# Altium schematic sheet GongxunZhukong.SchDoc
size A2; SheetNumber: 1; SheetTotal: 1
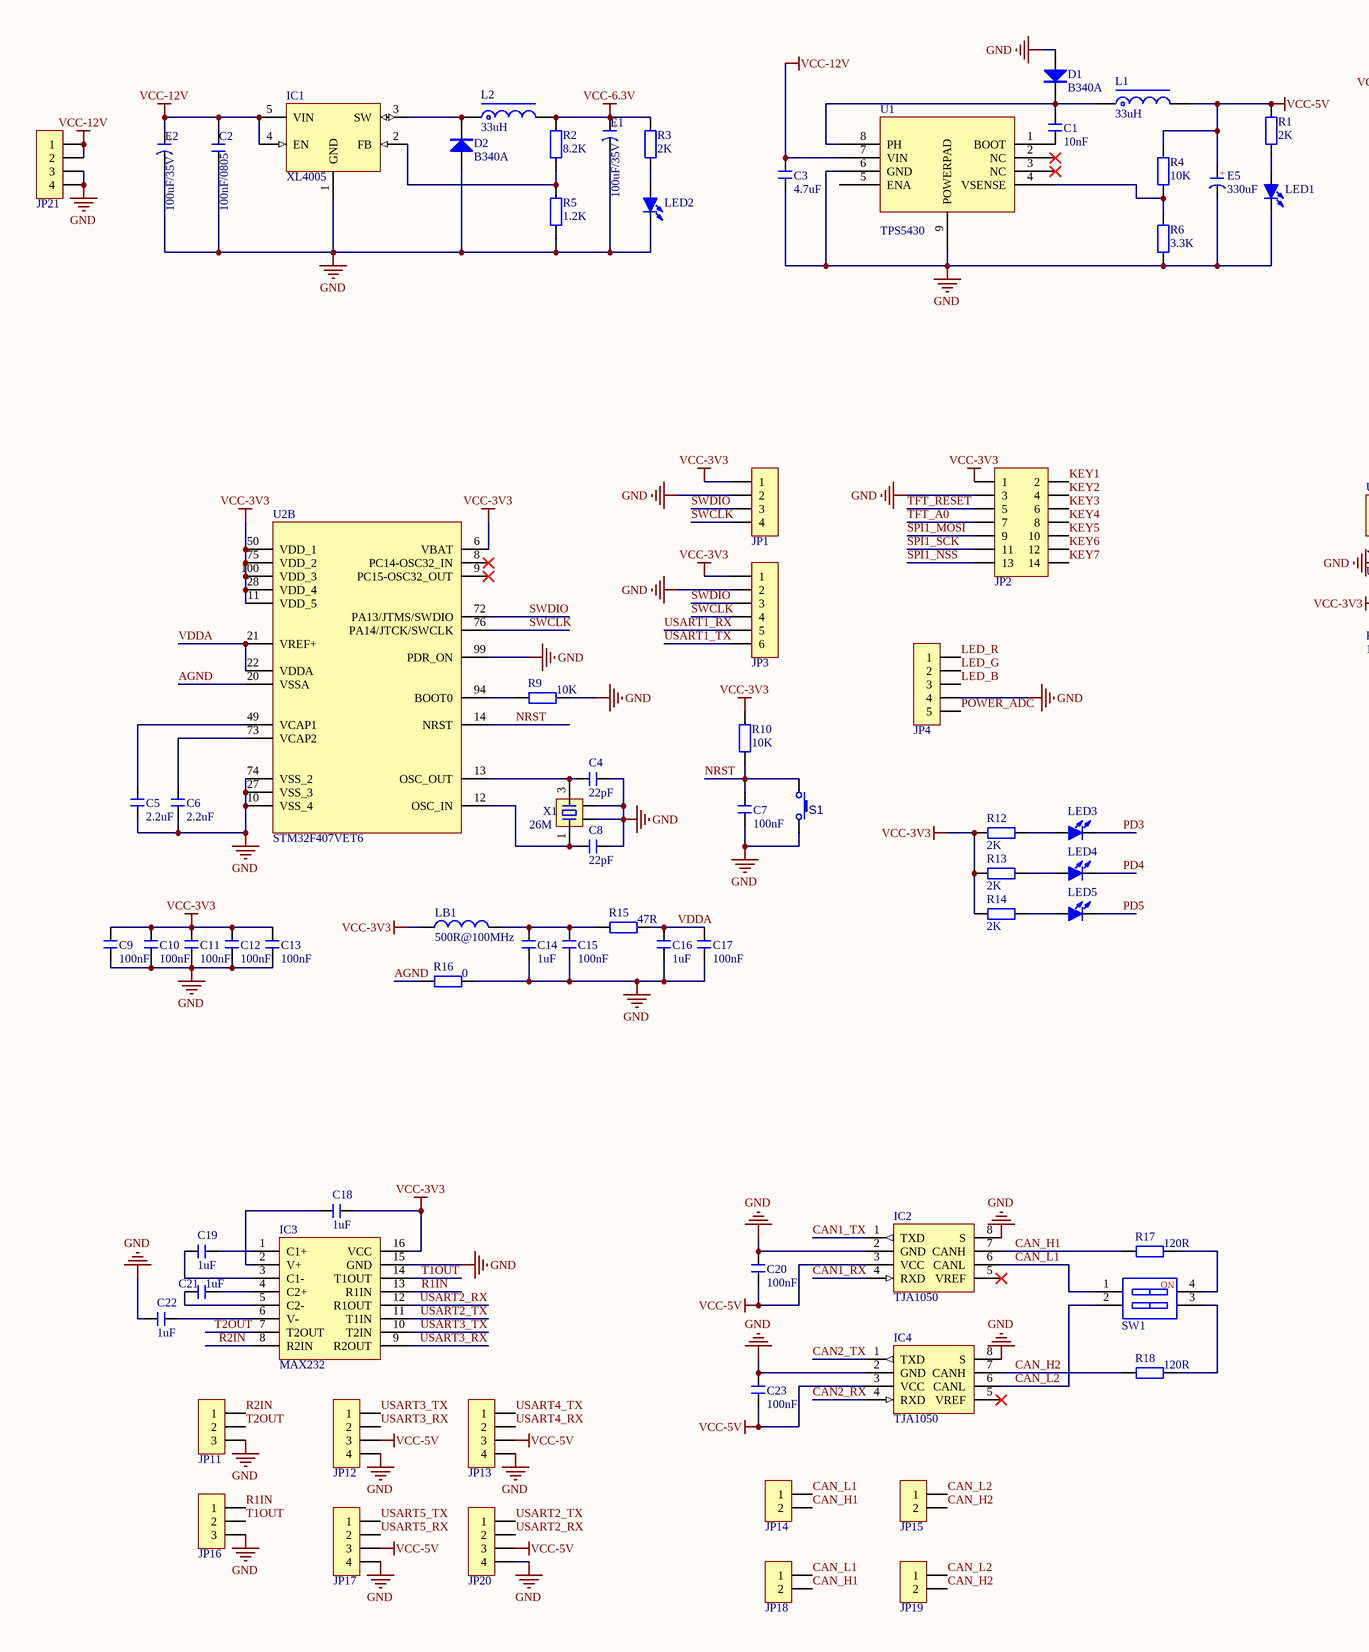
[diagram p0: GongxunZhukong.SchDoc, left]
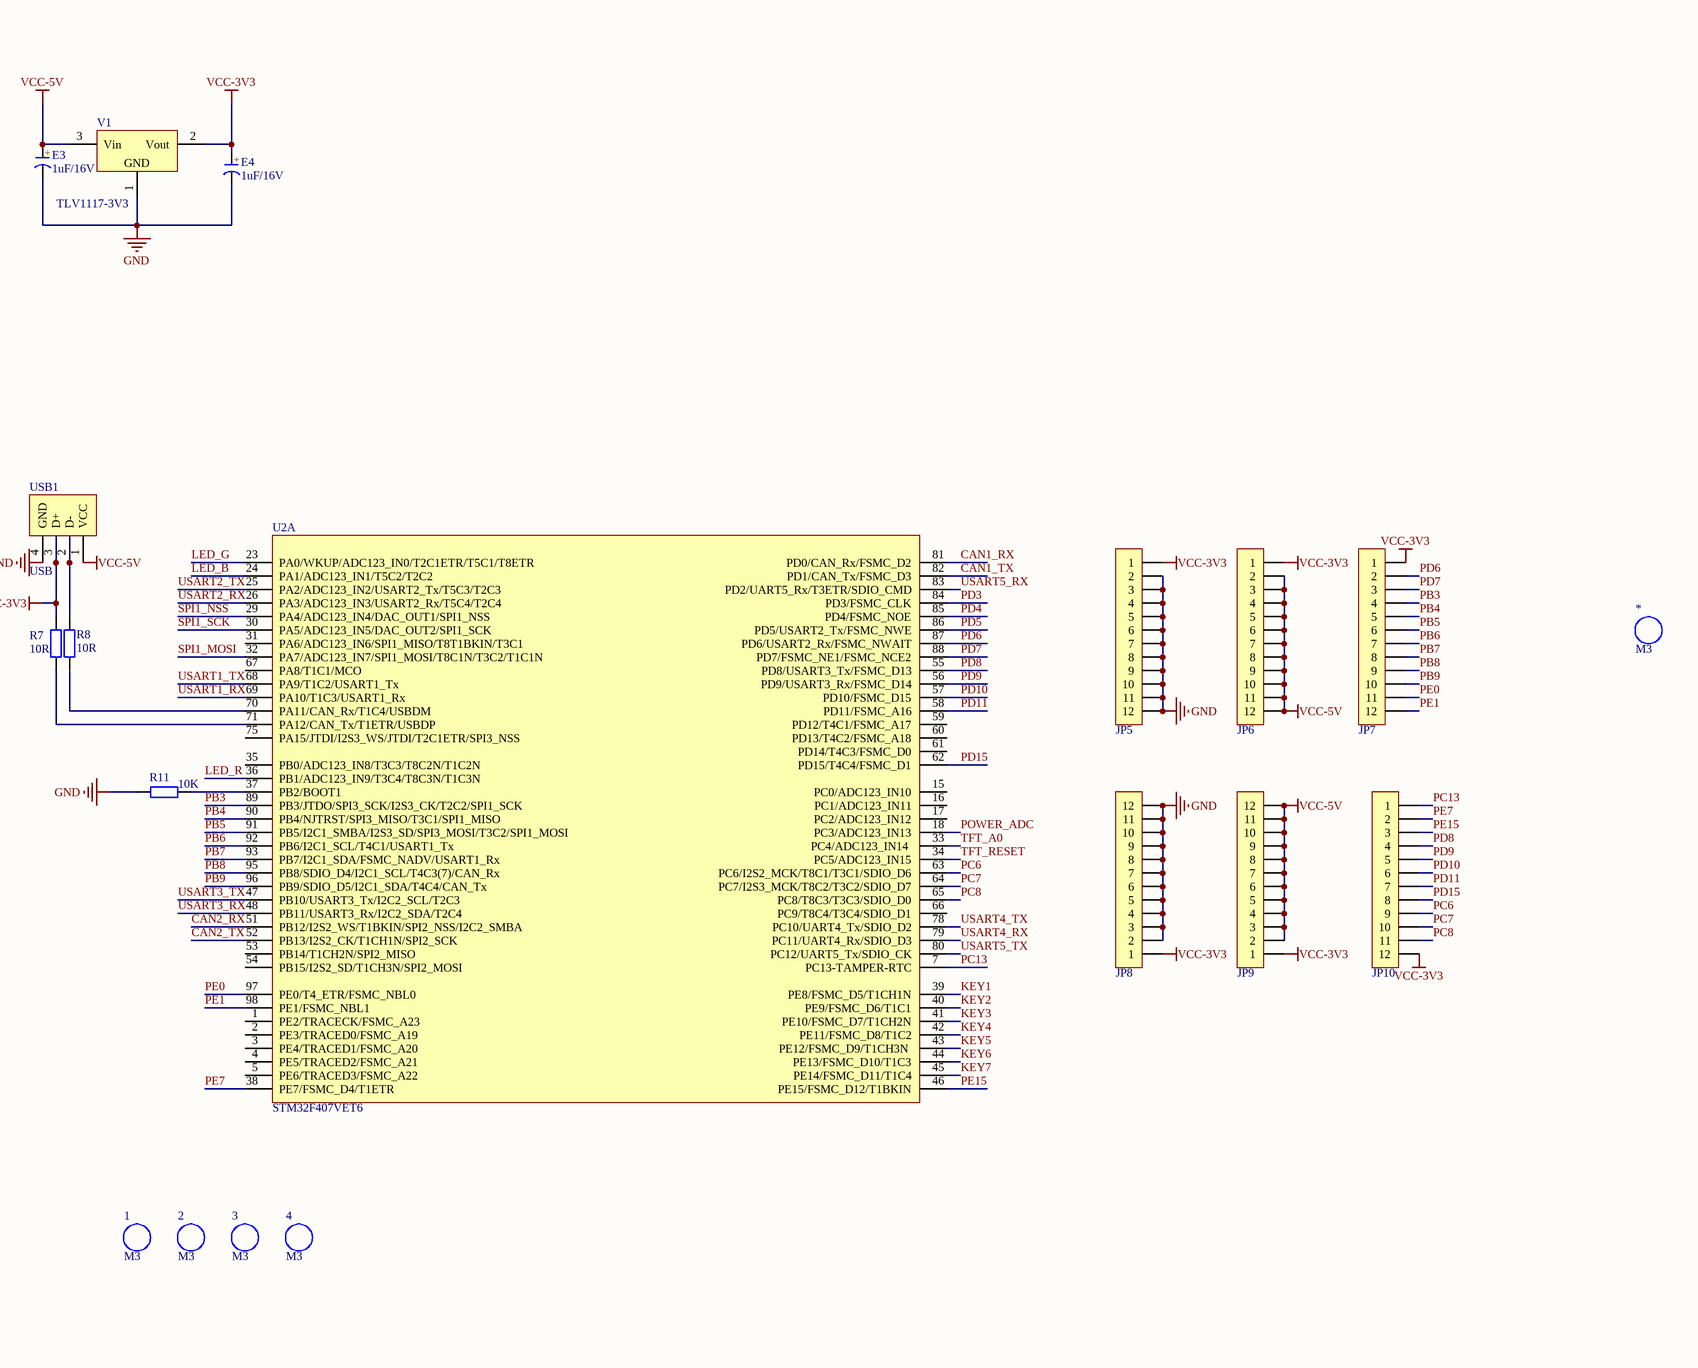
[diagram p1: GongxunZhukong.SchDoc, right]

## Parts
1  M3  [M3 125X200]
2  M3  [M3 125X200]
3  M3  [M3 125X200]
4  M3  [M3 125X200]
*  M3  [M3 125X200]
C1  10nF  [C 0603_M]
C2  100nF/0805  [C 0805_L]
C3  4.7uF  [C 0603_M]
C4  22pF  [C 0603_M]
C5  2.2uF  [C 0603_M]
C6  2.2uF  [C 0603_M]
C7  100nF  [C 0603_M]
C8  22pF  [C 0603_M]
C9  100nF  [C 0603_M]
C10  100nF  [C 0603_M]
C11  100nF  [C 0603_M]
C12  100nF  [C 0603_M]
C13  100nF  [C 0603_M]
C14  1uF  [C 0603_M]
C15  100nF  [C 0603_M]
C16  1uF  [C 0603_M]
C17  100nF  [C 0603_M]
C18  1uF  [C 0603_M]
C19  1uF  [C 0603_M]
C20  100nF  [C 0603_M]
C21  1uF  [C 0603_M]
C22  1uF  [C 0603_M]
C23  100nF  [C 0603_M]
D1  B340A  [SMA]
D2  B340A  [SMA]
E1  100uF/35V  [CM A(3*5.4)]
E2  100uF/35V  [CM A(3*5.4)]
E3  1uF/16V  [CD A(3216)]
E4  1uF/16V  [CD A(3216)]
E5  330uF  [CM D(6.3*7.7)]
IC1  XL4005  [TO263-5A]
IC2  TJA1050  [SOP8_N]
IC3  MAX232  [SOP16_N]
IC4  TJA1050  [SOP8_N]
JP1  HDR-1X4  [HDR2.54-LI-4P]  (value not drawn)
JP2  Header 2X7  [HDR2.54-LI-2x7P]  (value not drawn)
JP3  HDR-1X6  [PH2.0-WS-6P]  (value not drawn)
JP4  HDR-1X5  [PH2.0-WS-5P]  (value not drawn)
JP5  HDR-1X12  [HDR2.54-LI-12P]  (value not drawn)
JP6  HDR-1X12  [HDR2.54-LI-12P]  (value not drawn)
JP7  HDR-1X12  [HDR2.54-LI-12P]  (value not drawn)
JP8  HDR-1X12  [HDR2.54-LI-12P]  (value not drawn)
JP9  HDR-1X12  [HDR2.54-LI-12P]  (value not drawn)
JP10  HDR-1X12  [HDR2.54-LI-12P]  (value not drawn)
JP11  HDR-1X3  [PH2.0-WS-3P]  (value not drawn)
JP12  HDR-1X4  [HDR2.54-LI-4P]  (value not drawn)
JP13  HDR-1X4  [HDR2.54-LI-4P]  (value not drawn)
JP14  HDR-1X2  [PH2.0-WS-2P]  (value not drawn)
JP15  HDR-1X2  [PH2.0-WS-2P]  (value not drawn)
JP16  HDR-1X3  [PH2.0-WS-3P]  (value not drawn)
JP17  HDR-1X4  [HDR2.54-LI-4P]  (value not drawn)
JP18  HDR-1X2  [PH2.0-WS-2P]  (value not drawn)
JP19  HDR-1X2  [PH2.0-WS-2P]  (value not drawn)
JP20  HDR-1X4  [PH2.0-WS-4P]  (value not drawn)
JP21  HDR-1X4  [XH2.54-WS-4P]  (value not drawn)
L1  33uH  [CDRH74]
L2  33uH  [CDRH74]
LB1  500R@100MHz  [FB 0603_M]
LED1  (no value)  [LED 0603B]
LED2  (no value)  [LED 0603B]
LED3  (no value)  [LED 0603B]
LED4  (no value)  [LED 0603B]
LED5  (no value)  [LED 0603B]
R1  2K  [R 0603_M]
R2  8.2K  [R 0603_M]
R3  2K  [R 0603_M]
R4  10K  [R 0603_M]
R5  1.2K  [R 0603_M]
R6  3.3K  [R 0603_M]
R7  10R  [R 0603_M]
R8  10R  [R 0603_M]
R9  10K  [R 0603_M]
R10  10K  [R 0603_M]
R11  10K  [R 0603_M]
R12  2K  [R 0603_M]
R13  2K  [R 0603_M]
R14  2K  [R 0603_M]
R15  47R  [R 0603_M]
R16  0  [R 0603_M]
R17  120R  [R 0603_M]
R18  120R  [R 0603_M]
S1  Button  [PTS810-3*4-CurvePin]  (value not drawn)
SW1  CSW-2P  [CSW1.27 SMD-2P]  (value not drawn)
U1  TPS5430  [ESOP8_M]
U2  STM32F407VET6  [LQFP100 14x14_L]  (parts A,B of 2)
USB1  USB  [USB-A/S_A]
V1  TLV1117-3V3  [SOT223_N]
X1  26M  [OSC 3225-4P]

## Nets
GND: C2.1 C3.1 C4.1 C5.1 C6.1 C7.2 C8.1 C9.2 C10.2 C11.2 C12.2 C13.2 C14.2 C15.2 C16.2 C17.2 C20.1 C22.1 C23.1 D1.1(A) D2.1(A) E1.2(K) E2.2(K) E3.2(K) E4.2(K) E5.2(K) IC1.1(GND) IC2.2(GND) IC2.8(S) IC3.15(GND) IC4.2(GND) IC4.8(S) JP1.2 JP2.3 JP3.2 JP4.4 JP5.2 JP5.3 JP5.4 JP5.5 JP5.6 JP5.7 JP5.8 JP5.9 JP5.10 JP5.11 JP5.12 JP8.2 JP8.3 JP8.4 JP8.5 JP8.6 JP8.7 JP8.8 JP8.9 JP8.10 JP8.11 JP8.12 JP11.3 JP12.4 JP13.4 JP16.3 JP17.4 JP20.4 JP21.3 JP21.4 LED1.2(K) LED2.2(K) R5.1 R6.1 R9.1 R11.2 R16.1 S1.1 U1.6(GND) U1.9(POWERPAD) U2.10(VSS_4) U2.27(VSS_3) U2.74(VSS_2) U2.99(PDR_ON) USB1.4(GND) V1.1(GND) X1.2 X1.4
VCC-3V3: C9.1 C10.1 C11.1 C12.1 C13.1 C18.2 E4.1(A) IC3.16(VCC) JP1.1 JP2.1 JP3.1 JP5.1 JP6.1 JP7.1 JP8.1 JP9.1 JP10.12 LB1.1 R7.1 R10.1 R12.1 R13.1 R14.1 U2.6(VBAT) U2.11(VDD_5) U2.28(VDD_4) U2.50(VDD_1) U2.75(PA15/JTDI/I2S3_WS/JTDI/T2C1ETR/SPI3_NSS) U2.100(VDD_3) USB1.3(D+) V1.2(Vout)
VCC-5V: C20.2 C23.2 E3.1(A) E5.1(A) IC2.3(VCC) IC4.3(VCC) JP6.2 JP6.3 JP6.4 JP6.5 JP6.6 JP6.7 JP6.8 JP6.9 JP6.10 JP6.11 JP6.12 JP9.2 JP9.3 JP9.4 JP9.5 JP9.6 JP9.7 JP9.8 JP9.9 JP9.10 JP9.11 JP9.12 JP12.3 JP13.3 JP17.3 JP20.3 L1.2 R1.2 R4.2 USB1.1(VCC) V1.3(Vin)
VCC-6.3V: E1.1(A) L2.2 R2.2 R3.2
VCC-12V: C2.2 C3.2 E2.1(A) IC1.4(EN) IC1.5(VIN) JP21.1 JP21.2 U1.7(VIN)
AGND: R16.2 U2.20(VSSA)
CAN1_RX: IC2.4(RXD) U2.81(PD0/CAN_Rx/FSMC_D2)
CAN1_TX: IC2.1(TXD) U2.82(PD1/CAN_Tx/FSMC_D3)
CAN2_RX: IC4.4(RXD) U2.51(PB12/I2S2_WS/T1BKIN/SPI2_NSS/I2C2_SMBA)
CAN2_TX: IC4.1(TXD) U2.52(PB13/I2S2_CK/T1CH1N/SPI2_SCK)
CAN_H1: IC2.7(CANH) JP14.2 JP18.2 R17.2
CAN_H2: IC4.7(CANH) JP15.2 JP19.2 R18.2
CAN_L1: IC2.6(CANL) JP14.1 JP18.1 SW1.1
CAN_L2: IC4.6(CANL) JP15.1 JP19.1 SW1.2
KEY1: JP2.2 U2.39(PE8/FSMC_D5/T1CH1N)
KEY2: JP2.4 U2.40(PE9/FSMC_D6/T1C1)
KEY3: JP2.6 U2.41(PE10/FSMC_D7/T1CH2N)
KEY4: JP2.8 U2.42(PE11/FSMC_D8/T1C2)
KEY5: JP2.10 U2.43(PE12/FSMC_D9/T1CH3N)
KEY6: JP2.12 U2.44(PE13/FSMC_D10/T1C3)
KEY7: JP2.14 U2.45(PE14/FSMC_D11/T1C4)
LED_B: JP4.3 U2.24(PA1/ADC123_IN1/T5C2/T2C2)
LED_G: JP4.2 U2.23(PA0/WKUP/ADC123_IN0/T2C1ETR/T5C1/T8ETR)
LED_R: JP4.1 U2.36(PB1/ADC123_IN9/T3C4/T8C3N/T1C3N)
NRST: C7.1 R10.2 S1.2 U2.14(NRST)
PB3: JP7.4 U2.89(PB3/JTDO/SPI3_SCK/I2S3_CK/T2C2/SPI1_SCK)
PB4: JP7.5 U2.90(PB4/NJTRST/SPI3_MISO/T3C1/SPI1_MISO)
PB5: JP7.6 U2.91(PB5/I2C1_SMBA/I2S3_SD/SPI3_MOSI/T3C2/SPI1_MOSI)
PB6: JP7.7 U2.92(PB6/I2C1_SCL/T4C1/USART1_Tx)
PB7: JP7.8 U2.93(PB7/I2C1_SDA/FSMC_NADV/USART1_Rx)
PB8: JP7.9 U2.95(PB8/SDIO_D4/I2C1_SCL/T4C3(7)/CAN_Rx)
PB9: JP7.10 U2.96(PB9/SDIO_D5/I2C1_SDA/T4C4/CAN_Tx)
PC6: JP10.9 U2.63(PC6/I2S2_MCK/T8C1/T3C1/SDIO_D6)
PC7: JP10.10 U2.64(PC7/I2S3_MCK/T8C2/T3C2/SDIO_D7)
PC8: JP10.11 U2.65(PC8/T8C3/T3C3/SDIO_D0)
PC13: JP10.1 U2.7(PC13-TAMPER-RTC)
PD3: LED3.2(K) U2.84(PD3/FSMC_CLK)
PD4: LED4.2(K) U2.85(PD4/FSMC_NOE)
PD5: LED5.2(K) U2.86(PD5/USART2_Tx/FSMC_NWE)
PD6: JP7.2 U2.87(PD6/USART2_Rx/FSMC_NWAIT)
PD7: JP7.3 U2.88(PD7/FSMC_NE1/FSMC_NCE2)
PD8: JP10.4 U2.55(PD8/USART3_Tx/FSMC_D13)
PD9: JP10.5 U2.56(PD9/USART3_Rx/FSMC_D14)
PD10: JP10.6 U2.57(PD10/FSMC_D15)
PD11: JP10.7 U2.58(PD11/FSMC_A16)
PD15: JP10.8 U2.62(PD15/T4C4/FSMC_D1)
PE0: JP7.11 U2.97(PE0/T4_ETR/FSMC_NBL0)
PE1: JP7.12 U2.98(PE1/FSMC_NBL1)
PE7: JP10.2 U2.38(PE7/FSMC_D4/T1ETR)
PE15: JP10.3 U2.46(PE15/FSMC_D12/T1BKIN)
POWER_ADC: JP4.5 U2.18(PC3/ADC123_IN13)
R1IN: IC3.13(R1IN) JP16.1
R2IN: IC3.8(R2IN) JP11.1
SPI1_MOSI: JP2.9 U2.32(PA7/ADC123_IN7/SPI1_MOSI/T8C1N/T3C2/T1C1N)
SPI1_NSS: JP2.13 U2.29(PA4/ADC123_IN4/DAC_OUT1/SPI1_NSS)
SPI1_SCK: JP2.11 U2.30(PA5/ADC123_IN5/DAC_OUT2/SPI1_SCK)
SWCLK: JP1.4 JP3.4 U2.76(PA14/JTCK/SWCLK)
SWDIO: JP1.3 JP3.3 U2.72(PA13/JTMS/SWDIO)
T1OUT: IC3.14(T1OUT) JP16.2
T2OUT: IC3.7(T2OUT) JP11.2
TFT_A0: JP2.7 U2.33(PC4/ADC123_IN14)
TFT_RESET: JP2.5 U2.34(PC5/ADC123_IN15)
USART1_RX: JP3.5 U2.69(PA10/T1C3/USART1_Rx)
USART1_TX: JP3.6 U2.68(PA9/T1C2/USART1_Tx)
USART2_RX: IC3.12(R1OUT) JP20.2 U2.26(PA3/ADC123_IN3/USART2_Rx/T5C4/T2C4)
USART2_TX: IC3.11(T1IN) JP20.1 U2.25(PA2/ADC123_IN2/USART2_Tx/T5C3/T2C3)
USART3_RX: IC3.9(R2OUT) JP12.2 U2.48(PB11/USART3_Rx/I2C2_SDA/T2C4)
USART3_TX: IC3.10(T2IN) JP12.1 U2.47(PB10/USART3_Tx/I2C2_SCL/T2C3)
USART4_RX: JP13.2 U2.79(PC11/UART4_Rx/SDIO_D3)
USART4_TX: JP13.1 U2.78(PC10/UART4_Tx/SDIO_D2)
USART5_RX: JP17.2 U2.83(PD2/UART5_Rx/T3ETR/SDIO_CMD)
USART5_TX: JP17.1 U2.80(PC12/UART5_Tx/SDIO_CK)
VDDA: C16.1 C17.1 R15.1 U2.21(VREF+) U2.22(VDDA)
NetC1_1: C1.1 D1.2(K) L1.1 U1.8(PH)
NetC1_2: C1.2 U1.1(BOOT)
NetC4_2: C4.2 U2.13(OSC_OUT) X1.3
NetC5_2: C5.2 U2.49(VCAP1)
NetC6_2: C6.2 U2.73(VCAP2)
NetC8_2: C8.2 U2.12(OSC_IN) X1.1
NetC14_1: C14.1 C15.1 LB1.2 R15.2
NetC18_1: C18.1 IC3.2(V+)
NetC19_1: C19.1 IC3.1(C1+)
NetC19_2: C19.2 IC3.3(C1-)
NetC21_1: C21.1 IC3.5(C2-)
NetC21_2: C21.2 IC3.4(C2+)
NetC22_2: C22.2 IC3.6(V-)
NetD2_2: D2.2(K) IC1.3(SW) L2.1
NetIC1_2: IC1.2(FB) R2.1 R5.2
NetLED1_1: LED1.1(A) R1.1
NetLED2_1: LED2.1(A) R3.1
NetLED3_1: LED3.1(A) R12.2
NetLED4_1: LED4.1(A) R13.2
NetLED5_1: LED5.1(A) R14.2
NetR4_1: R4.1 R6.2 U1.4(VSENSE)
NetR7_2: R7.2 U2.71(PA12/CAN_Tx/T1ETR/USBDP)
NetR8_1: R8.1 USB1.2(D-)
NetR8_2: R8.2 U2.70(PA11/CAN_Rx/T1C4/USBDM)
NetR9_2: R9.2 U2.94(BOOT0)
NetR11_1: R11.1 U2.37(PB2/BOOT1)
NetR17_1: R17.1 SW1.4
NetR18_1: R18.1 SW1.3

Not connected (* = marked no-connect by the designer): IC2 5(VREF)*; IC4 5(VREF)*; U1 2(NC)* 3(NC)* 5(ENA); U2 1(PE2/TRACECK/FSMC_A23) 2(PE3/TRACED0/FSMC_A19) 3(PE4/TRACED1/FSMC_A20) 4(PE5/TRACED2/FSMC_A21) 5(PE6/TRACED3/FSMC_A22) 8(PC14-OSC32_IN)* 9(PC15-OSC32_OUT)* 15(PC0/ADC123_IN10) 16(PC1/ADC123_IN11) 17(PC2/ADC123_IN12) 31(PA6/ADC123_IN6/SPI1_MISO/T8T1BKIN/T3C1) 35(PB0/ADC123_IN8/T3C3/T8C2N/T1C2N) 53(PB14/T1CH2N/SPI2_MISO) 54(PB15/I2S2_SD/T1CH3N/SPI2_MOSI) 59(PD12/T4C1/FSMC_A17) 60(PD13/T4C2/FSMC_A18) 61(PD14/T4C3/FSMC_D0) 66(PC9/T8C4/T3C4/SDIO_D1) 67(PA8/T1C1/MCO)

## Notes on the sheet
- (in symbol C-CD) +
- (in symbol C-CM) +
- (in symbol CSW-2P) NO

## Library data of the parts
1-4 * = M3: 铜柱孔; BOM名称: 铜柱孔
C1-C23 = C: 无极性贴片电容; 材质: X7R; BOM名称: 无极性贴片电容
D1 D2 = M7: 整流二极管; BOM名称: 整流二极管
E1 E2 E5 = C-CM: 贴片电解电容; BOM名称: 贴片电解电容
E3 E4 = C-CD: 贴片钽电容; BOM名称: 贴片钽电容
IC1 = XL4005: DC降压芯片; BOM名称: DC降压芯片
IC2 IC4 = TJA1050: CAN总线收发芯片; BOM名称: CAN总线收发芯片
JP1 JP12 JP13 JP17 JP20 JP21 = Header 4: 4P接插件; BOM名称: 4P接插件
JP2 = Header 7X2: 7*2P接插件; BOM名称: 7*2P接插件
JP3 = Header 6: 6P接插件; BOM名称: 6P接插件
JP4 = Header 5: 5P接插件; BOM名称: 5P接插件
JP5-JP10 = Header 12: 12P接插件; BOM名称: 12P接插件
JP11 JP16 = Header 3: 3P接插件; BOM名称: 3P接插件
JP14 JP15 JP18 JP19 = Header 2: 2P接插件; BOM名称: 2P接插件
L1 L2 = L-CDRH: 功率屏蔽电感; BOM名称: 功率屏蔽电感
LB1 = LB: 磁珠; BOM名称: 磁珠
LED1-LED5 = LED-SMD: 贴片LED; BOM名称: 贴片LED
R1-R18 = R: 贴片电阻; BOM名称: 贴片电阻
S1 = KEY: 按键; Published: 24-Mar-1999; Publisher: Altium Limited; Price(RMB): 0.000
SW1 = CSW-2P: 2路编码开关; BOM名称: 2路编码开关
USB1 = USB-A/S: USB-A型母接口; BOM名称: USB-A型母接口
V1 = AMS1117: 三端稳压芯片; BOM名称: 稳压芯片
X1 = XTAL-4P: 4脚无源晶振; 负载电容: CL20pF; BOM名称: 4脚无源晶振
IC3 = MAX232: BOM名称: MAX232